# EAGLE schematic AR20_ETBC_rev1 (EAGLE 9.2.0)
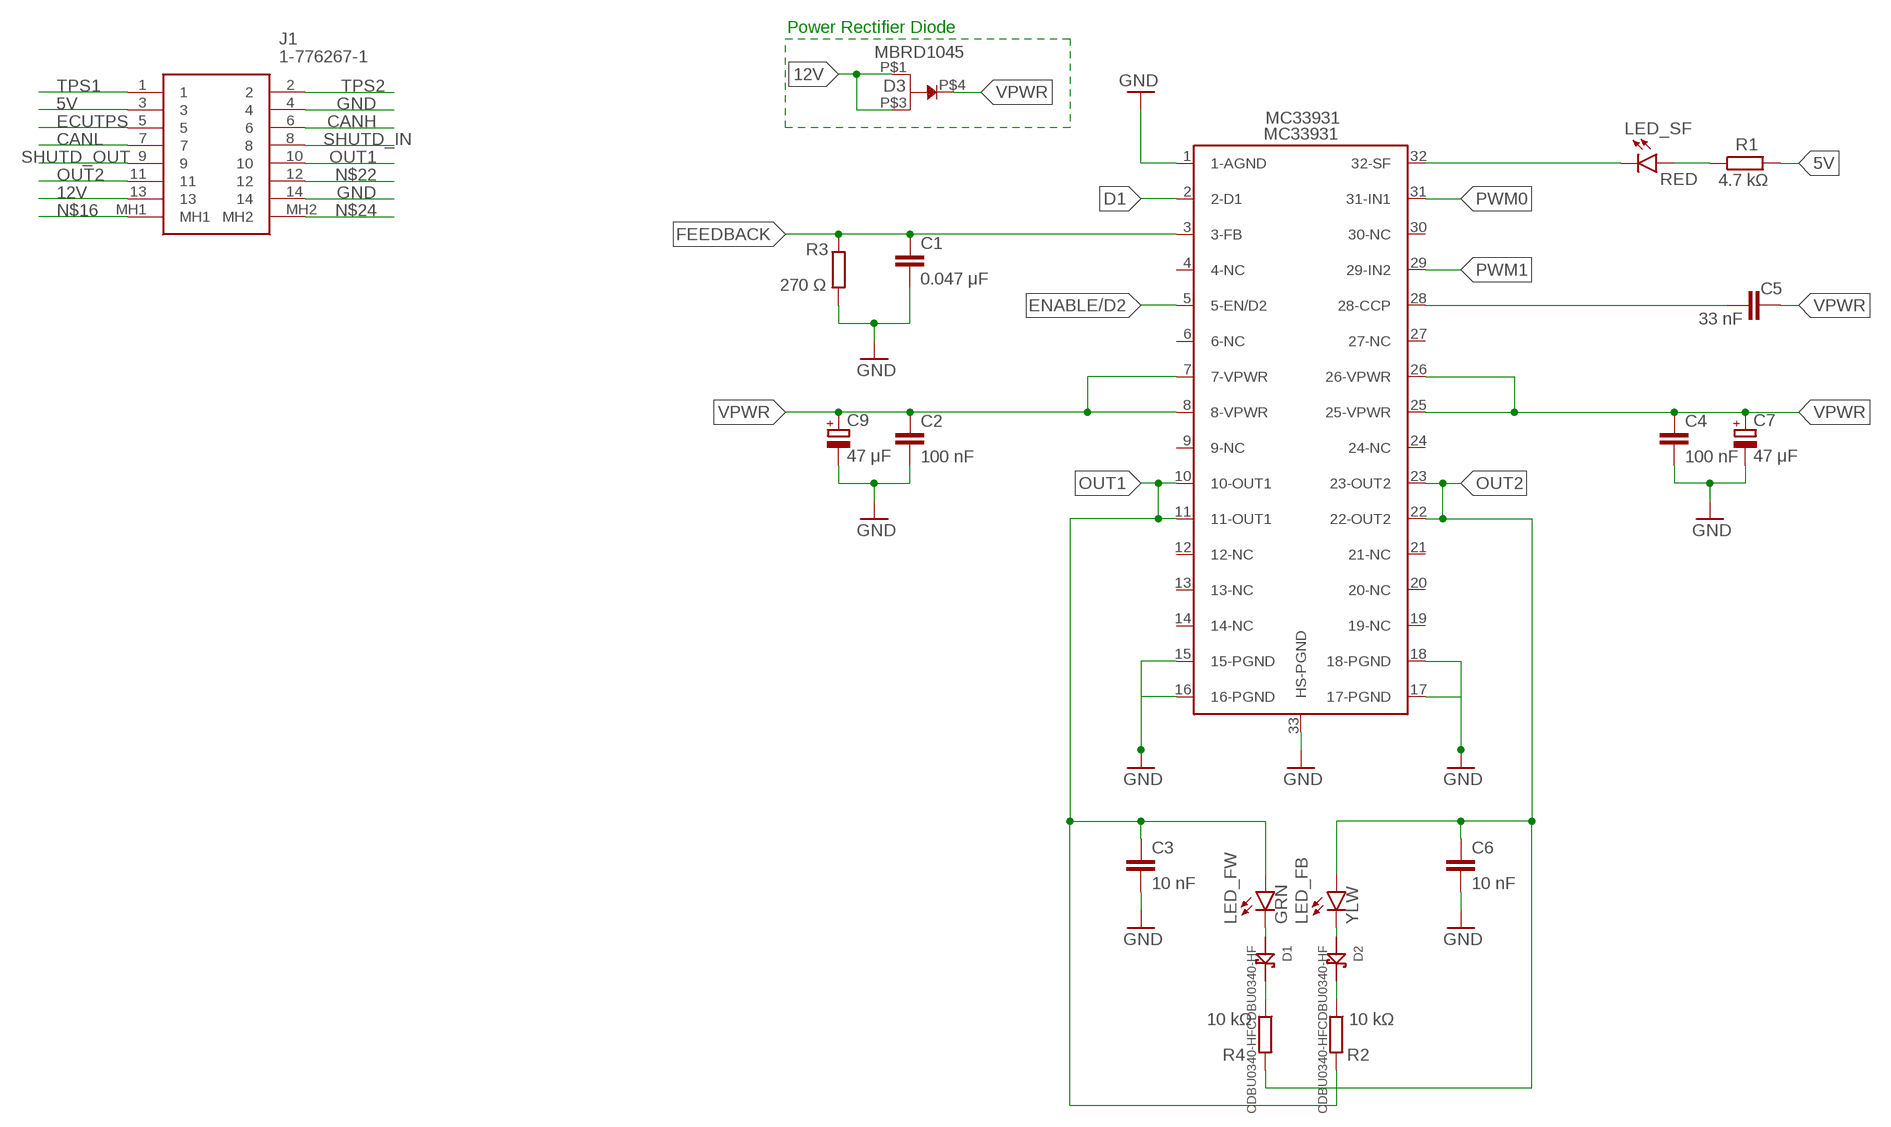
[diagram p0: schematic, sheet 1]

## Parts
C1  0.047 μF  C-EUC0603  [C0603]
C2  100 nF  C-EUC0603  [C0603]
C3  10 nF  C-EUC0603  [C0603]
C4  100 nF  C-EUC0603  [C0603]
C5  33 nF  C-EUC0603  [C0603]
C6  10 nF  C-EUC0603  [C0603]
C7  47 μF  CPOL-EUB45181A  [B45181A]
C9  47 μF  CPOL-EUB45181A  [B45181A]
D1  CDBU0340-HFCDBU0340-HF  [DIOM1709X85]
D2  CDBU0340-HFCDBU0340-HF  [DIOM1709X85]
D3  MBRD1045  [DPAK]
J1  1-776267-1  [17762671]
LED_FB  YLW  LEDSML1206  [SML1206]
LED_FW  GRN  LEDSML1206  [SML1206]
LED_SF  RED  LEDSML1206  [SML1206]
MC33931  MC33931  [SOP65P1030X245-33T480X861]
R1  4.7 kΩ  R-EU_R0603  [R0603]
R2  10 kΩ  R-EU_R0603  [R0603]
R3  270 Ω  R-EU_R0603  [R0603]
R4  10 kΩ  R-EU_R0603  [R0603]

## Nets
5V: J1.3 R1.2
12V: D3.P$1 D3.P$3 J1.13
CANH: J1.6
CANL: J1.7
D1: MC33931.2(2-D1)
ECUTPS: J1.5
ENABLE/D2: MC33931.5(5-EN/D2)
FEEDBACK: C1.1 MC33931.3(3-FB) R3.2
GND: C1.2 C2.2 C3.2 C4.2 C6.2 C7.- C9.- J1.4 J1.14 MC33931.1(1-AGND) MC33931.15(15-PGND) MC33931.16(16-PGND) MC33931.17(17-PGND) MC33931.18(18-PGND) MC33931.33(HS-PGND) R3.1
N$1: LED_SF.A R1.1
N$2: LED_SF.C MC33931.32(32-SF)
N$3: D2.2$A(A) LED_FB.C
N$4: C5.1 MC33931.28(28-CCP)
N$5: D1.2$A(A) LED_FW.C
N$6: D1.1$K(K) R4.1
N$7: D2.1$K(K) R2.1
N$16: J1.MH1
N$22: J1.12
N$24: J1.MH2
OUT1: C3.1 J1.10 LED_FW.A MC33931.10(10-OUT1) MC33931.11(11-OUT1) R2.2
OUT2: C6.1 J1.11 LED_FB.A MC33931.22(22-OUT2) MC33931.23(23-OUT2) R4.2
PWM0: MC33931.31(31-IN1)
PWM1: MC33931.29(29-IN2)
SHUTD_IN: J1.8
SHUTD_OUT: J1.9
TPS1: J1.1
TPS2: J1.2
VPWR: C2.1 C4.1 C5.2 C7.+ C9.+ D3.P$4 MC33931.7(7-VPWR) MC33931.8(8-VPWR) MC33931.25(25-VPWR) MC33931.26(26-VPWR)
Unconnected: MC33931.4(4-NC) MC33931.6(6-NC) MC33931.9(9-NC) MC33931.12(12-NC) MC33931.13(13-NC) MC33931.14(14-NC) MC33931.19(19-NC) MC33931.20(20-NC) MC33931.21(21-NC) MC33931.24(24-NC) MC33931.27(27-NC) MC33931.30(30-NC)

## Notes on the sheet
- Power Rectifier Diode

## Library data of the parts
C1-C6 = rcl:C-EU: CAPACITOR, European symbol; SPICEPREFIX: C
C7 C9 = rcl:CPOL-EU: POLARIZED CAPACITOR, European symbol; SPICEPREFIX: C
D1 D2 = AR19_ETC:CDBU0340-HF
D3 = AR19_ETC:MBRD1045
J1 = 1-776267-1:1-776267-1: AMP - TE CONNECTIVITY - 1-776267-1 - CONNECTOR, HEADER, THT, R/A, 4MM, 14WAY Source: Datasheet <https://www.te.com/commerce/DocumentDelivery/DDEController?Action=showdoc&DocId=Customer Drawing776267B7pdfEnglishENG_CD_776267_B7.pdf1-776267-1>; ALLIED_NUMBER: 70284283; ALLIED_PRICE-STOCK: https://www.alliedelec.com/teconnectivity-1-776267-1/70284283/; DESCRIPTION: AMP - TE CONNECTIVITY - 1-776267-1 - CONNECTOR, HEADER, THT, R/A, 4MM, 14WAY; HEIGHT: 32.3mm; MANUFACTURER_NAME: TE Connectivity; MANUFACTURER_PART_NUMBER: 1-776267-1; MOUSER_PART_NUMBER: 571-1-776267-1; MOUSER_PRICE-STOCK: https://www.mouser.com/Search/Refine.aspx?Keyword=571-1-776267-1
LED_FB LED_FW LED_SF = led:LED: LED OSRAM: - CHIPLED LG R971, LG N971, LY N971, LG Q971, LY Q971, LO R971, LY R971 LH N974, LH R974 LS Q976, LO Q976, LY Q976 LO Q996 - Hyper CHIPLED LW Q18S LB Q993, LB Q99A, LB R99A - SideLED LS A670, LO A670, LY A670, LG A670, LP A670 LB A673, LV A673, LT A673, LW A673 LH A674 LY A675 LS A676, LA A676, LO A676, LY A676, LW A676 LS A679, LY A679, LG A679 - Hyper Micro SIDELED® LS Y876, LA Y876, LO Y876, LY Y876 LT Y87S - SmartLED LW L88C, LW L88S LB L89C, LB L89S, LG L890 LS L89K, LO L89K, LY L89K LS L896, LA L896, LO L896, LY L896 - TOPLED LS T670, LO T670, LY T670, LG T670, LP T670 LSG T670, LSP T670, LSY T670, LOP T670, LYG T670 LG T671, LOG T671, LSG T671 LB T673, LV T673, LT T673, LW T673 LH T674 LS T676, LA T676, LO T676, LY T676, LB T676, LH T676, LSB T676, LW T676 LB T67C, LV T67C, LT T67C, LS T67K, LO T67K, LY T67K, LW E67C LS E67B, LA E67B, LO E67B, LY E67B, LB E67C, LV E67C, LT E67C LW T67C LS T679, LY T679, LG T679 LS T770, LO T770, LY T770, LG T770, LP T770 LB T773, LV T773, LT T773, LW T773 LH T774 LS E675, LA E675, LY E675, LS T675 LS T776, LA T776, LO T776, LY T776, LB T776 LHGB T686 LT T68C, LB T68C - Hyper Mini TOPLED® LB M676 - Mini TOPLED Santana® LG M470 LS M47K, LO M47K, LY M47K Source: http://www.osram.convergy.de LUXEON: - LUMILED® LXK2-PW12-R00, LXK2-PW12-S00, LXK2-PW14-U00, LXK2-PW14-V00 LXK2-PM12-R00, LXK2-PM12-S00, LXK2-PM14-U00 LXK2-PE12-Q00, LXK2-PE12-R00, LXK2-PE12-S00, LXK2-PE14-T00, LXK2-PE14-U00 LXK2-PB12-K00, LXK2-PB12-L00, LXK2-PB12-M00, LXK2-PB14-N00, LXK2-PB14-P00, LXK2-PB14-Q00 LXK2-PR12-L00, LXK2-PR12-M00, LXK2-PR14-Q00, LXK2-PR14-R00 LXK2-PD12-Q00, LXK2-PD12-R00, LXK2-PD12-S00 LXK2-PH12-R00, LXK2-PH12-S00 LXK2-PL12-P00, LXK2-PL12-Q00, LXK2-PL12-R00 Source: www.luxeon.com KINGBRIGHT: KA-3528ASYC Source: www.kingbright.com
MC33931 = AR19_ETC:MC33931
R1-R4 = rcl:R-EU_: RESISTOR, European symbol; SPICEPREFIX: R